# EAGLE schematic PCA9306_Breakout (EAGLE 6.4)
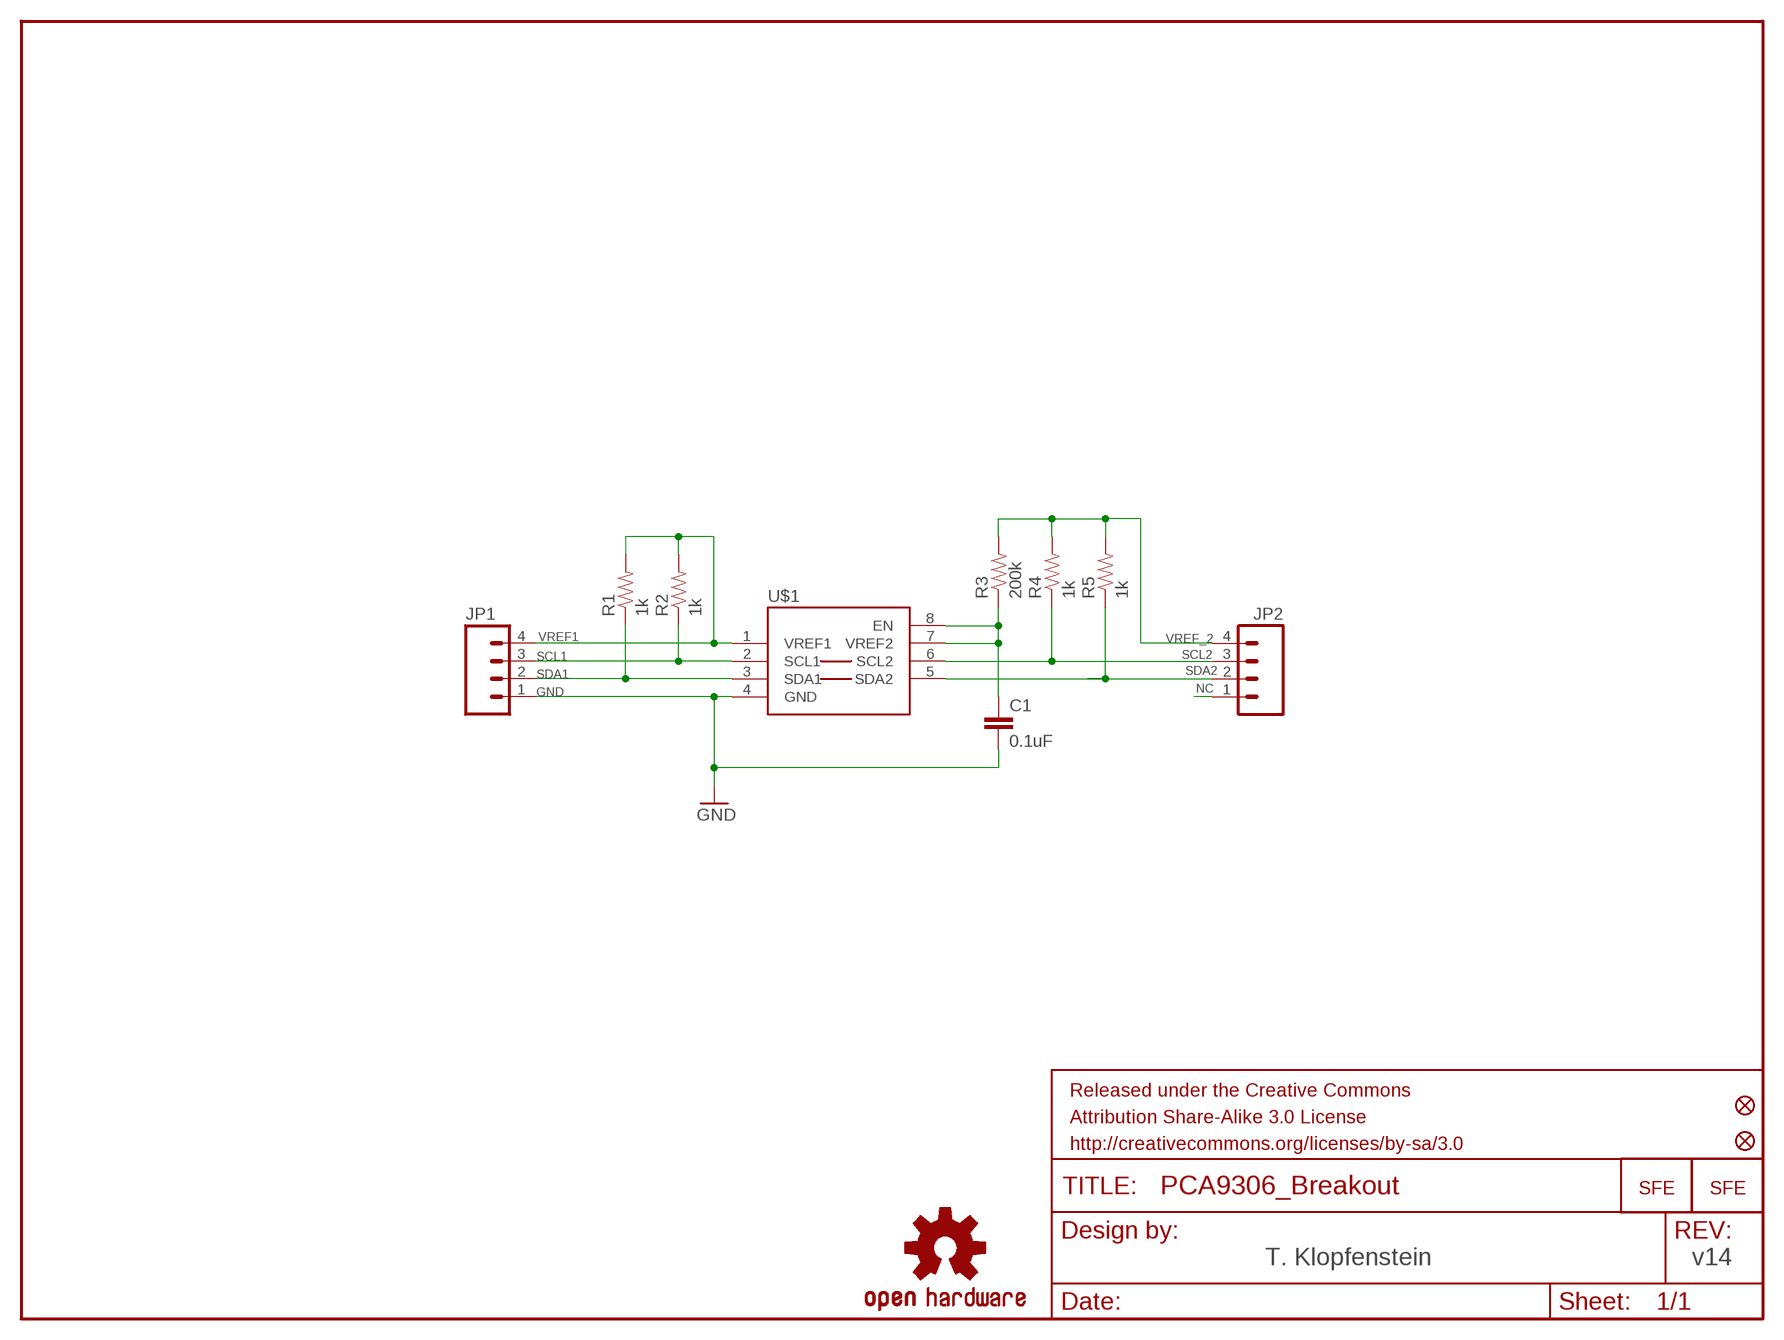
[diagram p0: schematic, sheet 1]

## Parts
C1  0.1uF  CAP0603-CAP  [0603-CAP]
FRAME1  FRAME-LETTER  [CREATIVE_COMMONS]
JP1  M04PTH  [1X04]
JP2  M04PTH  [1X04]
JP3  LOGO-SFESK  [SFE-LOGO-FLAME]
JP4  LOGO-SFESK  [SFE-LOGO-FLAME]
JP7  FIDUCIAL1X2.5  [FIDUCIAL-1X2.5]
JP8  FIDUCIAL1X2.5  [FIDUCIAL-1X2.5]
LOGO1  OSHW-LOGOS  [OSHW-LOGO-S]
R1  1k  RESISTOR0603-RES  [0603-RES]
R2  1k  RESISTOR0603-RES  [0603-RES]
R3  200k  RESISTOR0603-RES  [0603-RES]
R4  1k  RESISTOR0603-RES  [0603-RES]
R5  1k  RESISTOR0603-RES  [0603-RES]
U$1  PCA9306  [PSOP-8]

## Nets
GND: C1.2 JP1.1 U$1.4(GND)
NC: JP2.1
SCL1: JP1.3 R2.1 U$1.2(SCL1)
SCL2: JP2.3 R4.1 U$1.6(SCL2)
SDA1: JP1.2 R1.1 U$1.3(SDA1)
SDA2: JP2.2 R5.1 U$1.5(SDA2)
VREF1: JP1.4 R1.2 R2.2 U$1.1(VREF1)
VREF2: C1.1 R3.1 U$1.7(VREF2) U$1.8(EN)
VREF_2: JP2.4 R3.2 R4.2 R5.2

## Notes on the sheet
- T. Klopfenstein | v14

## Library data of the parts
C1 = SparkFun:CAP: Capacitor Standard 0603 ceramic capacitor, and 0.1" leaded capacitor.
FRAME1 = SparkFun-Aesthetics:FRAME-LETTER: Schematic Frame Standard 8.5x11 US Letter frame
JP1 JP2 = SparkFun:M04: Header 4 Standard 4-pin 0.1" header. Use with straight break away headers (SKU : PRT-00116), right angle break away headers (PRT-00553), swiss pins (PRT-00743), machine pins (PRT-00117), and female headers (PRT-00115). Molex polarized connector foot print use with SKU : PRT-08231 with associated crimp pins and housings.
JP3 JP4 = SparkFun:LOGO-SFE: Spark Fun Electronics PCB Logo This is the standard Spark Fun Electronics PCB logo.
JP7 JP8 = abes:FIDUCIAL: Fiducial Alignment Points Various fiducial points for machine vision alignment.
LOGO1 = SparkFun-Aesthetics:OSHW-LOGO: Open Source Hardware Logo This logo indicates the piece of hardware it is found on incorporates a OSHW license and/or adheres to the definition of open source hardware found here: http://freedomdefined.org/OSHW
R1-R5 = SparkFun:RESISTOR: Resistor Basic schematic elements and footprints for 0603, 1206, and PTH resistors.
U$1 = SparkFun-DigitalIC:PCA9306: Bidirectional I2C level shifter. NOT compatible with all available part number pinout schemes- DOUBLE CHECK!!!; PROD_ID: IC-10023